# Altium schematic sheet Power&USB.SchDoc
size A; SheetNumber: 1; SheetTotal: 3
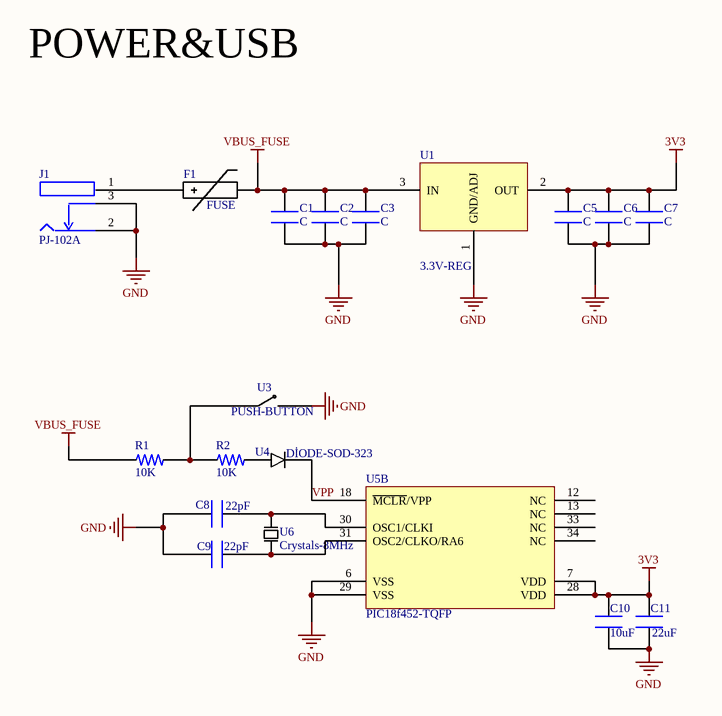
[diagram p0: Power&USB.SchDoc]

## Parts
C1  C  [PCBComponent_1]
C2  C  [PCBComponent_1]
C3  C  [PCBComponent_1]
C5  C  [PCBComponent_1]
C6  C  [PCBComponent_1]
C7  C  [PCBComponent_1]
C8  22pF  [PCBComponent_1]
C9  22pF  [PCBComponent_1]
C10  10uF  [PCBComponent_1]
C11  22uF  [PCBComponent_1]
F1  FUSE  [PCBComponent_1]
J1  PJ-102A  [FP-PJ-102A-MFG]
R1  10K  [PCBComponent_1]
R2  10K  [PCBComponent_1]
U1  3.3V-REG  [PCBComponent_1]
U3  PUSH-BUTTON  [PCBComponent_1]
U4  DİODE-SOD-323  [PCBComponent_1]
U5  PIC18f452-TQFP  [PCBComponent_1]  (part B of 2)
U6  Crystals-8MHz  [PCBComponent_1]

## Nets
3V3: C5.2 C6.2 C7.2 C10.2 C11.2 U1.2(OUT) U5.7(VDD) U5.28(VDD)
GND: C1.1 C2.1 C3.1 C5.1 C6.1 C7.1 C8.2 C9.2 C10.1 C11.1 J1.2 J1.3 U1.1(GND/ADJ) U3.2 U5.6(VSS) U5.29(VSS)
VBUS_FUSE: C1.2 C2.2 C3.2 F1.9 R1.1 U1.3(IN)
VPP: U4.2 U5.18(~{MCLR}/VPP)
NetC8_1: C8.1 U5.30(OSC1/CLKI) U6.2
NetC9_1: C9.1 U5.31(OSC2/CLKO/RA6) U6.1
NetF1_8: F1.8 J1.1
NetR1_2: R1.2 R2.1 U3.1
NetR2_2: R2.2 U4.1

Not connected (* = marked no-connect by the designer): U5 12(NC) 13(NC) 33(NC) 34(NC)

## Notes on the sheet
- POWER&USB

## Library data of the parts
C1-C3 C5-C11 = 1206-CAPACİTOR
F1 = Component_1
J1 = CMP-2000-06899-2: CONN PWR JACK 2X5.5MM SOLDER; Manufacturer: CUI; Conn Gender: Male; Voltage: 24V; Industry Recognized Mating Diameter: 2.10mm ID (0.083"), 5.50mm OD (0.217"); Number Of Contacts: 3; Number of Positions/Contacts: 2 Conductors, 3 Contacts; Current Rating: 2.5A; Conn Orientation: Right Angle; ComponentLink2URL: http://www.cui.com/product/resource/pj-102a.pdf; Manufacturer Part Number: PJ-102A; Contact Material: Tin,Nickel; Digikey Description: CONN PWR JACK 2X5.5MM SOLDER; RoHS: TRUE; Height: 11.2mm; Category: Conn; Octopart: https://octopart.com/pj-102a-cui-286936; Device Class L1: Connectors; Automotive: No; Package: PJ-102A; Device Class L2: Power Connectors; Temperature Range Low: -25°C; Temperature: -25°C to +85°C; Mouser Description: DC Power Connectors Power Jacks; Lead Free: Yes; Device Class L3: unset; Voltage Rating: 24V; ComponentLink2Description: Datasheet; Temperature Range High: +85°C
R1 R2 = 1206-RESİSTOR
U1 = LD1117AG-33-AA3-A-R
U3 = DS1042-03-2-1-KKA-160-10
U4 = 1N4148WS-HT
U6 = Crystals-8MHz-SMD